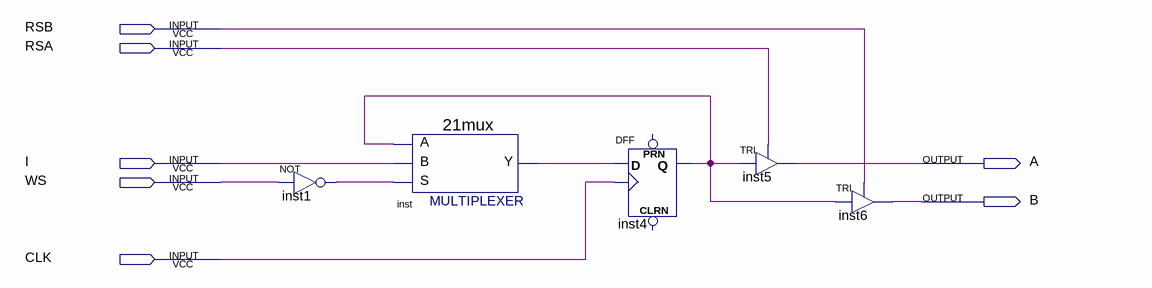
[diagram p0: schematic sheet]
// Quartus schematic RFC1.bdf as structural Verilog: 5 symbols, 7 pins
module RFC1 (
  input  RSB,
  input  RSA,
  input  I,
  input  WS,
  input  CLK,
  output A,
  output B
);

  wire inst1_out, inst4_q, inst_y;

  not inst1 (inst1_out, WS);
  \21mux  inst (.S(inst1_out), .B(I), .A(inst4_q), .Y(inst_y));
  DFF inst4 (.CLK(CLK), .D(inst_y), .Q(inst4_q));  // open: CLRN, PRN
  TRI inst5 (.IN(inst4_q), .OE(RSA), .OUT(A));
  TRI inst6 (.IN(inst4_q), .OE(RSB), .OUT(B));
endmodule
